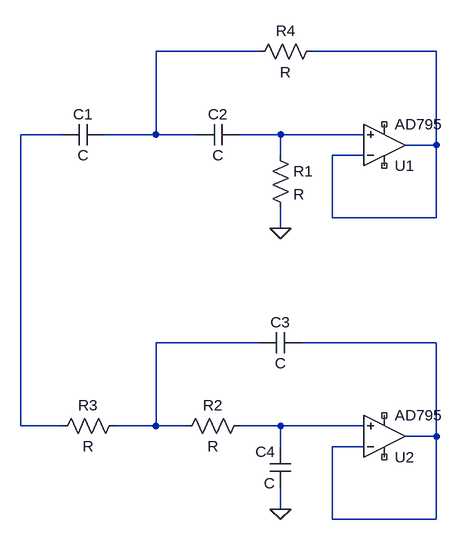
[diagram p0: schematic Draft1.asc]
Draft1.asc, the LTspice schematic file:
Version 4
SHEET 1 880 680
WIRE -16 -144 -176 -144
WIRE 256 -144 64 -144
WIRE -320 -16 -384 -16
WIRE -176 -16 -176 -144
WIRE -176 -16 -256 -16
WIRE -112 -16 -176 -16
WIRE 16 -16 -48 -16
WIRE 144 -16 16 -16
WIRE 256 0 256 -144
WIRE 256 0 208 0
WIRE 16 16 16 -16
WIRE 144 16 96 16
WIRE 96 112 96 16
WIRE 256 112 256 0
WIRE 256 112 96 112
WIRE 16 128 16 96
WIRE -16 304 -176 304
WIRE 256 304 48 304
WIRE -384 432 -384 -16
WIRE -320 432 -384 432
WIRE -176 432 -176 304
WIRE -176 432 -240 432
WIRE -128 432 -176 432
WIRE 16 432 -48 432
WIRE 144 432 16 432
WIRE 256 448 256 304
WIRE 256 448 208 448
WIRE 16 464 16 432
WIRE 144 464 96 464
WIRE 16 560 16 528
WIRE 96 576 96 464
WIRE 256 576 256 448
WIRE 256 576 96 576
FLAG 16 128 0
FLAG 16 560 0
SYMBOL OpAmps\\AD795 176 64 M180
SYMATTR InstName U1
SYMBOL OpAmps\\AD795 176 512 M180
SYMATTR InstName U2
SYMBOL cap -256 -32 R90
WINDOW 0 0 32 VBottom 2
WINDOW 3 32 32 VTop 2
SYMATTR InstName C1
SYMBOL cap -48 -32 R90
WINDOW 0 0 32 VBottom 2
WINDOW 3 32 32 VTop 2
SYMATTR InstName C2
SYMBOL cap 48 288 R90
WINDOW 0 0 32 VBottom 2
WINDOW 3 32 32 VTop 2
SYMATTR InstName C3
SYMBOL cap 32 528 R180
WINDOW 0 24 56 Left 2
WINDOW 3 24 8 Left 2
SYMATTR InstName C4
SYMBOL res 0 0 R0
SYMATTR InstName R1
SYMBOL res -32 416 R90
WINDOW 0 0 56 VBottom 2
WINDOW 3 32 56 VTop 2
SYMATTR InstName R2
SYMBOL res -224 416 R90
WINDOW 0 0 56 VBottom 2
WINDOW 3 32 56 VTop 2
SYMATTR InstName R3
SYMBOL res 80 -160 R90
WINDOW 0 0 56 VBottom 2
WINDOW 3 32 56 VTop 2
SYMATTR InstName R4

The netlist it stands for:
* Draft1.asc
XU1 N004 N002 NC_01 NC_02 N002 AD795  ; pins In+ In- V+ V- OUT
XU2 N007 N006 NC_03 NC_04 N006 AD795  ; pins In+ In- V+ V- OUT
C1 N001 N003 C
C2 N004 N001 C
C3 N006 N005 C
C4 0 N007 C
R1 N004 0 R
R2 N007 N005 R
R3 N005 N003 R
R4 N002 N001 R
.lib ADI1.lib
.backanno
.end